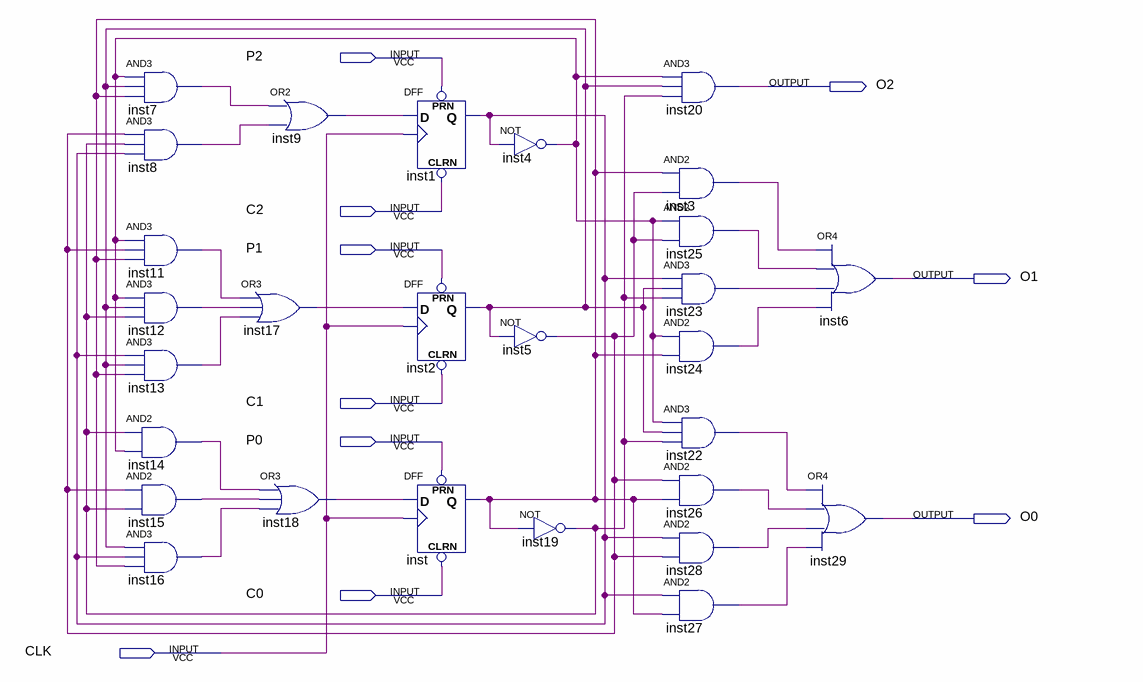
[diagram p0: schematic sheet]
// Quartus schematic Student ID_Code_Counter_Serial_Design.bdf as structural Verilog: 28 symbols, 10 pins
module \Student_ID_Code_Counter_Serial_Design  (
  input  P2,
  input  C2,
  input  P1,
  input  C1,
  input  P0,
  input  C0,
  input  CLK,
  output O2,
  output O1,
  output O0
);

  wire inst1_q, inst2_q, inst3_out, inst4_out, inst5_out, inst7_out, inst8_out, inst9_out, inst11_out,
       inst12_out, inst13_out, inst14_out, inst15_out, inst16_out, inst17_out, inst18_out, inst19_out,
       inst22_out, inst23_out, inst24_out, inst25_out, inst26_out, inst27_out, inst28_out, inst_q;

  and inst7 (inst7_out, inst4_out, inst2_q, inst_q);
  and inst8 (inst8_out, inst5_out, inst19_out, inst1_q);
  and inst11 (inst11_out, inst4_out, inst5_out, inst_q);
  and inst12 (inst12_out, inst4_out, inst2_q, inst19_out);
  and inst13 (inst13_out, inst1_q, inst2_q, inst_q);
  and inst14 (inst14_out, inst19_out, inst4_out);
  and inst15 (inst15_out, inst5_out, inst19_out);
  and inst16 (inst16_out, inst2_q, inst1_q, inst_q);
  or inst9 (inst9_out, inst7_out, inst8_out);
  or inst17 (inst17_out, inst11_out, inst12_out, inst13_out);
  or inst18 (inst18_out, inst14_out, inst15_out, inst16_out);
  DFF inst1 (.CLRN(C2), .CLK(CLK), .D(inst9_out), .PRN(P2), .Q(inst1_q));
  DFF inst2 (.CLRN(C1), .CLK(CLK), .D(inst17_out), .PRN(P1), .Q(inst2_q));
  DFF inst (.CLRN(C0), .CLK(CLK), .D(inst18_out), .PRN(P0), .Q(inst_q));
  not inst4 (inst4_out, inst1_q);
  not inst5 (inst5_out, inst2_q);
  not inst19 (inst19_out, inst_q);
  and inst20 (O2, inst4_out, inst2_q, inst19_out);
  and inst3 (inst3_out, inst_q, inst5_out);
  and inst25 (inst25_out, inst4_out, inst5_out);
  and inst23 (inst23_out, inst1_q, inst2_q, inst19_out);
  and inst24 (inst24_out, inst4_out, inst_q);
  and inst22 (inst22_out, inst4_out, inst2_q, inst19_out);
  and inst26 (inst26_out, inst5_out, inst_q);
  and inst28 (inst28_out, inst1_q, inst5_out);
  and inst27 (inst27_out, inst1_q, inst_q);
  or inst6 (O1, inst3_out, inst25_out, inst23_out, inst24_out);
  or inst29 (O0, inst22_out, inst26_out, inst28_out, inst27_out);
endmodule
